# Altium schematic sheet SD_USB_FMU_REV_2A.SchDoc: Cube Yellow and Cube Orange
size A3; Date: 18/08/2014 1:53:11 PM; Author: PR; DrawnBy: Philip Rowse; Engineer: Philip Rowse; Organization: ProfiCNC/Hex; Address3: VIC; Address4: Australia; Revision: A; SheetNumber: 8; SheetTotal: 10
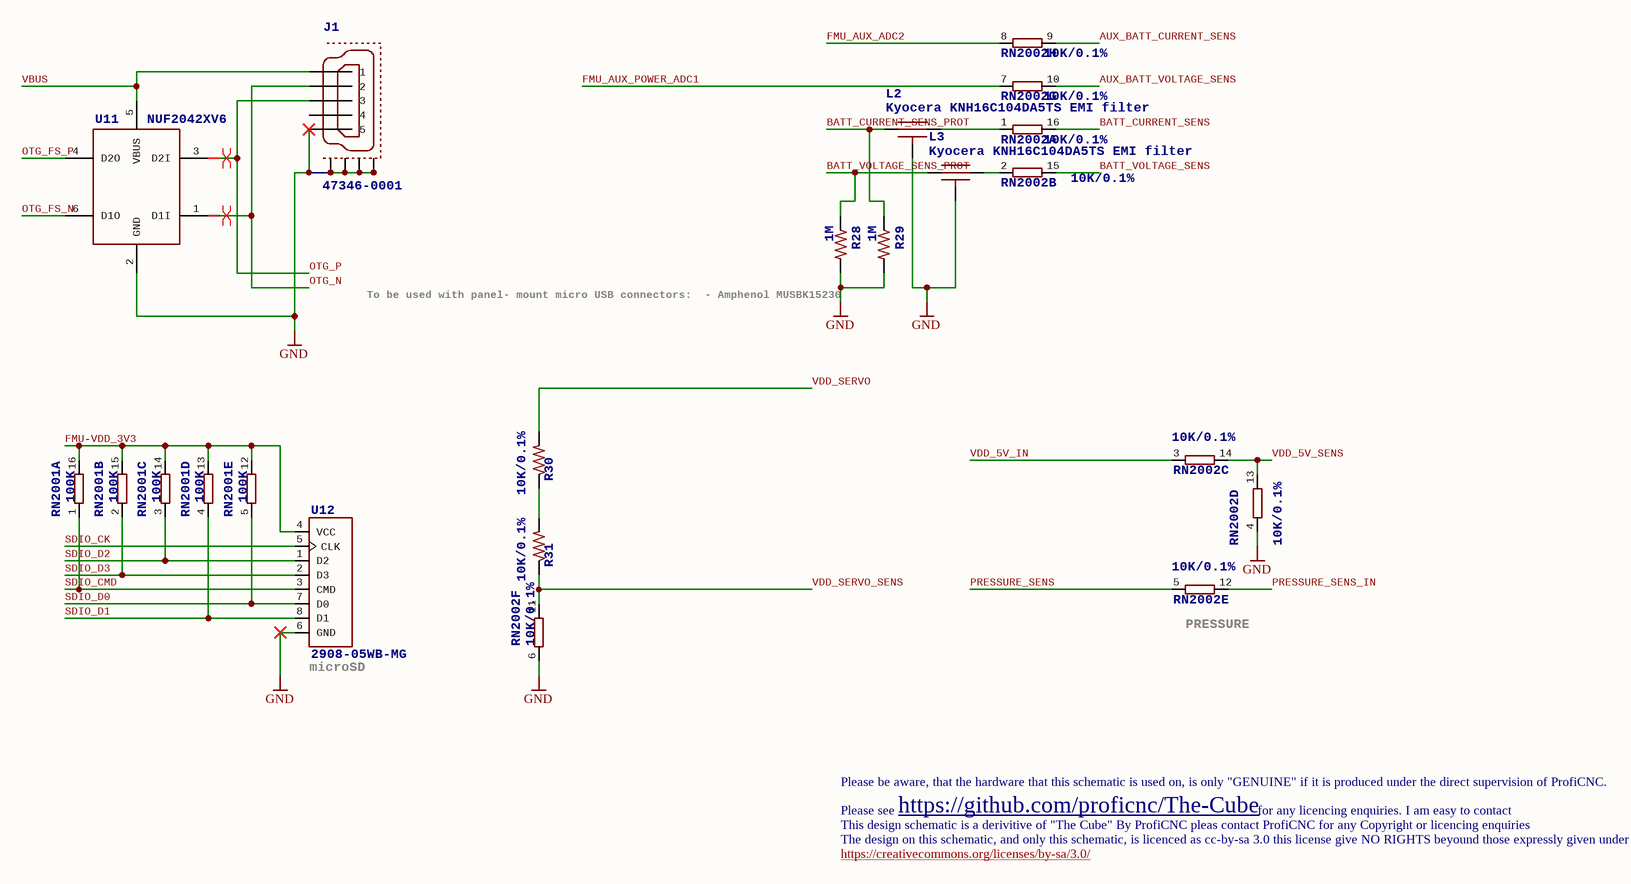
[diagram p0: SD_USB_FMU_REV_2A.SchDoc]

## Parts
J1  47346-0001  [MOLEX-47346-0001]
L2  Kyocera KNH16C104DA5TS EMI filter  [KYOCERA-KNH16-DA]
L3  Kyocera KNH16C104DA5TS EMI filter  [KYOCERA-KNH16-DA]
R28  1M  [0402-RES]
R29  1M  [0402-RES]
R30  10K/0.1%  [0402-RES]
R31  10K/0.1%  [0402-RES]
RN2001  100K  [EXB2HV]  (parts A,B,C,D,E of 8)
RN2002  10K/0.1%  [EXB2HV]  (parts A,B,C,D,E,F,G,H of 8)
U11  NUF2042XV6  [SOT563-6]
U12  2908-05WB-MG  [MICROSD]

## Nets
GND: J1.GND(5) J1.GND1 J1.GND2 J1.GND3 J1.GND4 L2.GND L3.GND R28.P$2 R29.P$2 RN2002.4 RN2002.6 U11.2(GND) U12.6(GND)
AUX_BATT_CURRENT_SENS: RN2002.9
AUX_BATT_VOLTAGE_SENS: RN2002.10
BATT_CURRENT_SENS: RN2002.16
BATT_CURRENT_SENS_PROT: L2.P$1 R29.P$1
BATT_VOLTAGE_SENS: RN2002.15
BATT_VOLTAGE_SENS_PROT: L3.P$1 R28.P$1
FMU-VDD_3V3: RN2001.12 RN2001.13 RN2001.14 RN2001.15 RN2001.16 U12.4(VCC)
FMU_AUX_ADC2: RN2002.8
FMU_AUX_POWER_ADC1: RN2002.7
OTG_FS_N: U11.6(D1O)
OTG_FS_P: U11.4(D2O)
OTG_N: J1.D-(2) U11.1(D1I)
OTG_P: J1.D+(3) U11.3(D2I)
PRESSURE_SENS: RN2002.5
PRESSURE_SENS_IN: RN2002.12
SDIO_CK: U12.5(CLK)
SDIO_CMD: RN2001.1 U12.3(CMD)
SDIO_D0: RN2001.5 U12.7(D0)
SDIO_D1: RN2001.4 U12.8(D1)
SDIO_D2: RN2001.3 U12.1(D2)
SDIO_D3: RN2001.2 U12.2(D3)
VBUS: J1.VBUS(1) U11.5(VBUS)
VDD_5V_IN: RN2002.3
VDD_5V_SENS: RN2002.13 RN2002.14
VDD_SERVO: R30.P$2
VDD_SERVO_SENS: R31.P$1 RN2002.11
NetL2_P$2: L2.P$2 RN2002.1
NetL3_P$2: L3.P$2 RN2002.2
NetR30_P$1: R30.P$1 R31.P$2

Not connected (* = marked no-connect by the designer): J1 ID(4)

## Layout directives
differential pair: OTG_N, OTG_P

## Notes on the sheet
- To be used with panel-
  mount micro USB connectors:
  - Amphenol MUSBK15230
- (near RN2002) PRESSURE
- (near U12) microSD
- Please be aware, that the hardware that this schematic is used on, is only "GENUINE" if it is produced under the direct supervision of ProfiCNC.
- The design on this schematic, and only this schematic, is licenced as cc-by-sa 3.0 this license give NO RIGHTS beyound those expressly given under the terms of this license.
- This design schematic is a derivitive of "The Cube" By ProfiCNC pleas contact ProfiCNC for any Copyright or licencing enquiries
- https://creativecommons.org/licenses/by-sa/3.0/
- Please see
- https://github.com/proficnc/The-Cube
- for any licencing enquiries. I am easy to contact
- Drawn By:
- Verified for production by:
- Approved for release:
- Title
- Size:
- Date:
- A
- Number:
- Time:
- Revision:
- Sheet
- of
- File:

## Library data of the parts
J1 = MOLEX-47346-0001: MICRO USB B, BOTTOM MOUNT
L2 L3 = KNH16C104DA5TS: FILTER CAP 0.1UF 2A 25V 0603; Value: 0u1
R28 R29 = RESISTOR0402-RES: RES 1M OHM 1/16W 1% 0402 SMD; Value: 1M
R30 R31 = RESISTOR0402-RES: RES 10K OHM 1/16W .1% 0402 SMD; Value: 10K
RN2001 = 8R-NEXB2HV-100K: RES ARRAY 100K OHM 8 RES 1506; Value: 100K
RN2002 = 8R-NEXB2HV-10K: RES ARRAY 10K OHM 8 RES 1506; Value: 10K
U11 = NUF2042XV6: IC FILTER USB ESD PROTECT SOT363
U12 = MICROSDSDI: CONN MICRO SD CARD PUSH-PUSH R/A